# Altium schematic sheet fitolamp_shc.SchDoc
size A2
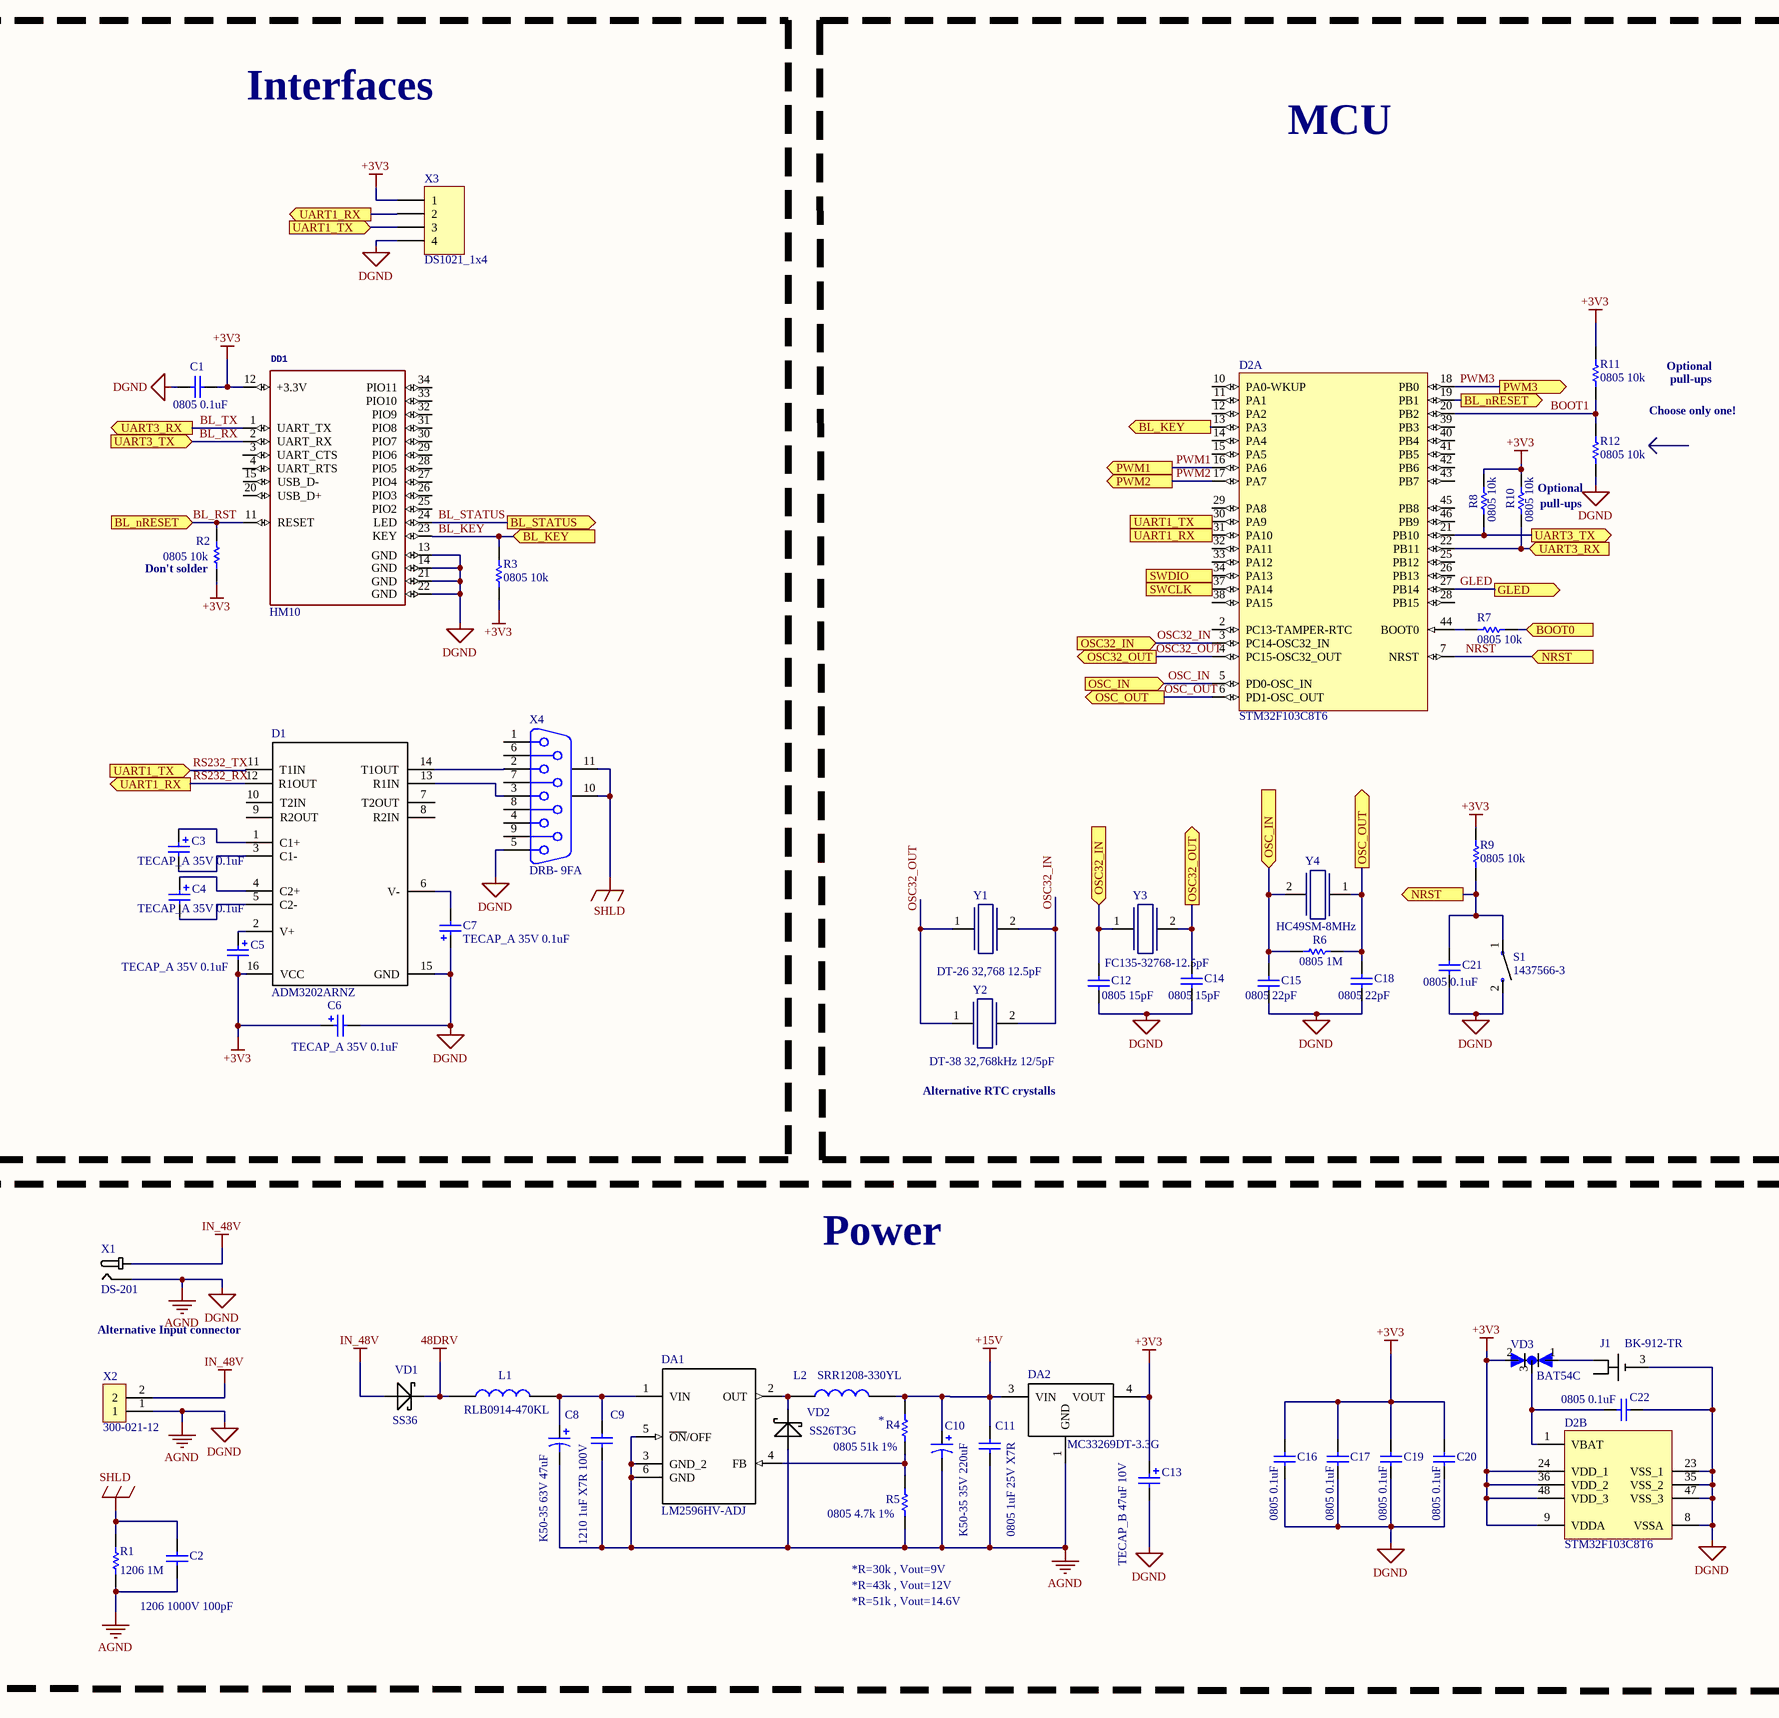
[diagram p0: fitolamp_shc.SchDoc, left]
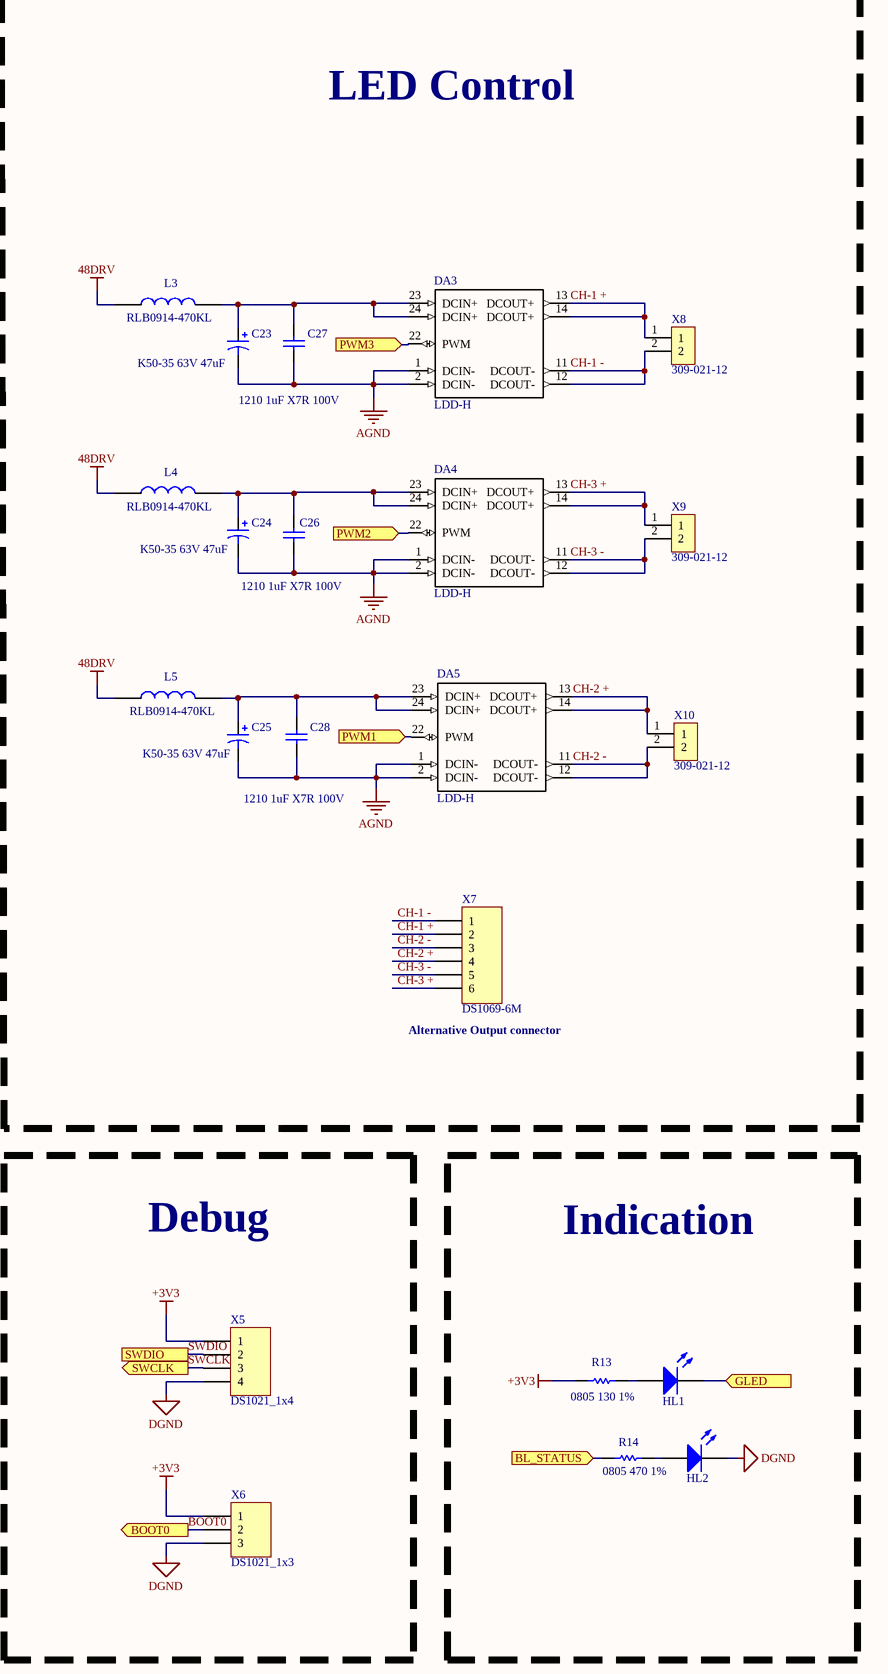
[diagram p1: fitolamp_shc.SchDoc, right]

## Parts
C1  0805 0.1uF  [C_SMD0805]
C2  1206 1000V 100pF  [C_SMD1206]
C3  TECAP_A 35V 0.1uF  [TECAP_A]
C4  TECAP_A 35V 0.1uF  [TECAP_A]
C5  TECAP_A 35V 0.1uF  [TECAP_A]
C6  TECAP_A 35V 0.1uF  [TECAP_A]
C7  TECAP_A 35V 0.1uF  [TECAP_A]
C8  K50-35 63V 47uF  [K50-35 6.3x11x2.5]
C9  1210 1uF X7R 100V  [C_SMD1210]
C10  K50-35 35V 220uF  [K50-35 8x11.5x3.5]
C11  0805 1uF 25V X7R  [C_SMD0805]
C12  0805 15pF  [C_SMD0805]
C13  TECAP_B 47uF 10V  [TECAP_B]
C14  0805 15pF  [C_SMD0805]
C15  0805 22pF  [C_SMD0805]
C16  0805 0.1uF  [C_SMD0805]
C17  0805 0.1uF  [C_SMD0805]
C18  0805 22pF  [C_SMD0805]
C19  0805 0.1uF  [C_SMD0805]
C20  0805 0.1uF  [C_SMD0805]
C21  0805 0.1uF  [C_SMD0805]
C22  0805 0.1uF  [C_SMD0805]
C23  K50-35 63V 47uF  [K50-35 6.3x11x2.5]
C24  K50-35 63V 47uF  [K50-35 6.3x11x2.5]
C25  K50-35 63V 47uF  [K50-35 6.3x11x2.5]
C26  1210 1uF X7R 100V  [C_SMD1210]
C27  1210 1uF X7R 100V  [C_SMD1210]
C28  1210 1uF X7R 100V  [C_SMD1210]
D1  ADM3202ARNZ  [SOIC-16]
D2  STM32F103C8T6  [STM-LQFP48_N]  (parts A,B of 2)
DA1  LM2596HV-ADJ  [TO263-5 - heatsink]
DA2  MC33269DT-3.3G  [DPAK229P990X238-3N]
DA3  LDD-H  [LDD-H]
DA4  LDD-H  [LDD-H]
DA5  LDD-H  [LDD-H]
DD1  HM10  [HM10_BOARD]
HL1  LED_0_25_4  [LED0254_SMD]  (value not drawn)
HL2  LED_0_25_4  [LED0254_SMD]  (value not drawn)
J1  BK-912-TR  [BK-912-TR_batt]
L1  RLB0914-470KL  [RLB0914]
L2  SRR1208-330YL  [SRR1208]
L3  RLB0914-470KL  [RLB0914]
L4  RLB0914-470KL  [RLB0914]
L5  RLB0914-470KL  [RLB0914]
R1  1206 1M  [R_SMD1206]
R2  0805 10k  [R_SMD0805]
R3  0805 10k  [R_SMD0805]
R4  0805 51k 1%  [R_SMD0805]
R5  0805 4.7k 1%  [R_SMD0805]
R6  0805 1M  [R_SMD0805]
R7  0805 10k  [R_SMD0805]
R8  0805 10k  [R_SMD0805]
R9  0805 10k  [R_SMD0805]
R10  0805 10k  [R_SMD0805]
R11  0805 10k  [R_SMD0805]
R12  0805 10k  [R_SMD0805]
R13  0805 130 1%  [R_SMD0805]
R14  0805 470 1%  [R_SMD0805]
S1  1437566-3  [1437566-3]
VD1  SS36  [DO214AB SMC]
VD2  SS26T3G  [DO-214AA]
VD3  BAT54C  [BAT54C_SOT23-3]
X1  DS-201  [DS-201]
X2  300-021-12  [300-021-12]
X3  DS1021_1x4  [PLD1X4]
X4  DRB- 9FA  [DRB- 9FA]
X5  DS1021_1x4  [PLD1X4]
X6  DS1021_1x3  [PLD1x3]
X7  DS1069-6M  [DS1069-6MR]
X8  309-021-12  [390-021-12]
X9  309-021-12  [390-021-12]
X10  309-021-12  [390-021-12]
Y1  DT-26 32,768 12.5pF  [DT-26]
Y2  DT-38 32,768kHz 12/5pF  [DT-38]
Y3  FC135-32768-12.5pF  [FC-135]
Y4  HC49SM-8MHz  [HC49SM]

## Blocks framed on the sheet
Interfaces: C1 C3-C7 D1 DD1 R2 R3 X3 X4

## Ports
BL_KEY (in), BL_KEY (out), BL_nRESET (in), BL_nRESET (out), BL_STATUS (in), BL_STATUS (out), BOOT0 (in), BOOT0 (out), GLED (in), GLED (out), NRST (in), NRST (out), OSC32_IN (in), OSC32_OUT (out), OSC_IN (in), OSC_OUT (out), PWM1 (in), PWM1 (out), PWM2 (in), PWM2 (out), PWM3 (in), PWM3 (out), SWCLK (in), SWCLK (out), SWDIO, UART1_RX (in), UART1_RX (out), UART1_TX (in), UART1_TX (out), UART3_RX (in), UART3_RX (out), UART3_TX (in), UART3_TX (out)

## Nets
48DRV: L1.1 L3.1 L4.1 L5.1 VD1.2(NEG)
+3V3: C1.1 C5.2 C6.1 C13.1 C16.2 C17.2 C19.2 C20.2 D1.16(VCC) D2.9(VDDA) D2.24(VDD_1) D2.36(VDD_2) D2.48(VDD_3) DA2.4(VOUT) DD1.12(+3.3V) R2.2 R3.2 R8.1 R9.1 R10.1 R11.1 R13.1 VD3.2(A2) X3.1 X5.1 X6.1
+15V: C10.1 C11.2 DA2.3(VIN) L2.2 R4.2
AGND: C1.2 C2.1 C6.2 C7.1 C8.2 C9.1 C10.2 C11.1 C12.1 C13.2 C14.1 C15.1 C16.1 C17.1 C18.1 C19.1 C20.1 C21.1 C22.1 C23.2 C24.2 C25.2 C26.1 C27.1 C28.1 D1.15(GND) D2.8(VSSA) D2.23(VSS_1) D2.35(VSS_2) D2.47(VSS_3) DA1.3(GND_2) DA1.5(~{ON}/OFF) DA1.6(GND) DA2.1(GND) DA3.1(DCIN-) DA3.2(DCIN-) DA4.1(DCIN-) DA4.2(DCIN-) DA5.1(DCIN-) DA5.2(DCIN-) DD1.13(GND) DD1.14(GND) DD1.21(GND) DD1.22(GND) HL2.2(K) J1.3(NEG) R1.1 R5.1 R12.2 S1.2 VD2.2(POS) X1.1(SHIELD) X2.1 X3.4 X4.5 X5.4 X6.3  [also labelled DGND]
IN_48V: VD1.1(POS) X1.2 X2.2
SHLD: C2.2 R1.2 X4.10(MH1) X4.11(MH2)
BL_KEY: D2.13(PA3) DD1.23(KEY) R3.1 ; port BL_KEY
BL_RST: D2.19(PB1) DD1.11(RESET) R2.1 ; port BL_nRESET
BL_RX: D2.21(PB10) DD1.2(UART_RX) R8.2 ; port UART3_TX
BL_STATUS: DD1.24(LED) R14.1 ; port BL_STATUS
BL_TX: D2.22(PB11) DD1.1(UART_TX) R10.2 ; port UART3_RX
BOOT0: R7.2 X6.2 ; port BOOT0
BOOT1: D2.20(PB2) R11.2 R12.1
CH-1 +: DA3.13(DCOUT+) DA3.14(DCOUT+) X7.2 X8.1
CH-1 -: DA3.11(DCOUT-) DA3.12(DCOUT-) X7.1 X8.2
CH-2 +: DA5.13(DCOUT+) DA5.14(DCOUT+) X7.4 X10.1
CH-2 -: DA5.11(DCOUT-) DA5.12(DCOUT-) X7.3 X10.2
CH-3 +: DA4.13(DCOUT+) DA4.14(DCOUT+) X7.6 X9.1
CH-3 -: DA4.11(DCOUT-) DA4.12(DCOUT-) X7.5 X9.2
GLED: D2.27(PB14) HL1.2(K) ; port GLED
NRST: C21.2 D2.7(NRST) R9.2 S1.1 ; port NRST
OSC32_IN: C12.2 D2.3(PC14-OSC32_IN) Y1.2 Y2.2 Y3.1 ; port OSC32_IN
OSC32_OUT: C14.2 D2.4(PC15-OSC32_OUT) Y1.1 Y2.1 Y3.2 ; port OSC32_OUT
OSC_IN: C15.2 D2.5(PD0-OSC_IN) R6.2 Y4.2 ; port OSC_IN
OSC_OUT: C18.2 D2.6(PD1-OSC_OUT) R6.1 Y4.1 ; port OSC_OUT
PWM1: D2.16(PA6) DA5.22(PWM) ; port PWM1
PWM2: D2.17(PA7) DA4.22(PWM) ; port PWM2
PWM3: D2.18(PB0) DA3.22(PWM) ; port PWM3
RS232_RX: D1.12(R1OUT) D2.31(PA10) X3.2 ; port UART1_RX
RS232_TX: D1.11(T1IN) D2.30(PA9) X3.3 ; port UART1_TX
SWCLK: D2.37(PA14) X5.3 ; port SWCLK
SWDIO: D2.34(PA13) X5.2 ; port SWDIO
NetC3_1: C3.1 D1.1(C1+)
NetC3_2: C3.2 D1.3(C1-)
NetC4_1: C4.1 D1.4(C2+)
NetC4_2: C4.2 D1.5(C2-)
NetC5_1: C5.1 D1.2(V+)
NetC7_2: C7.2 D1.6(V-)
NetC8_1: C8.1 C9.2 DA1.1(VIN) L1.2
NetC22_2: C22.2 D2.1(VBAT) VD3.3(C)
NetC23_1: C23.1 C27.2 DA3.23(DCIN+) DA3.24(DCIN+) L3.2
NetC24_1: C24.1 C26.2 DA4.23(DCIN+) DA4.24(DCIN+) L4.2
NetC25_1: C25.1 C28.2 DA5.23(DCIN+) DA5.24(DCIN+) L5.2
NetD1_13: D1.13(R1IN) X4.3
NetD1_14: D1.14(T1OUT) X4.2
NetD2_44: D2.44(BOOT0) R7.1
NetDA1_2: DA1.2(OUT) L2.1 VD2.1(NEG)
NetDA1_4: DA1.4(FB) R4.1 R5.2
NetHL1_1: HL1.1(A) R13.2
NetHL2_1: HL2.1(A) R14.2
NetJ1_2: J1.2(POS) VD3.1(A1)

Not connected (* = marked no-connect by the designer): D1 7(T2OUT) 8(R2IN) 9(R2OUT) 10(T2IN); D2 2(PC13-TAMPER-RTC) 10(PA0-WKUP) 11(PA1) 12(PA2) 14(PA4) 15(PA5) 25(PB12) 26(PB13) 28(PB15) 29(PA8) 32(PA11) 33(PA12) 38(PA15) 39(PB3) 40(PB4) 41(PB5) 42(PB6) 43(PB7) 45(PB8) 46(PB9); DD1 3(UART_CTS) 4(UART_RTS) 15(USB_D-) 20(USB_D+) 25(PIO2) 26(PIO3) 27(PIO4) 28(PIO5) 29(PIO6) 30(PIO7) 31(PIO8) 32(PIO9) 33(PIO10) 34(PIO11); J1 1(POS); X4 1 4 6 7 8 9

## Notes on the sheet
- MCU
- LED Control
- Choose only one!
- Optional
- pull-ups
- (near R10) pull-ups
- (near R2) Don't solder
- (near X7) Alternative Output connector
- Alternative RTC crystalls
- Power
- Debug
- Indication
- Alternative Input connector
- *
- *R=43k , Vout=12V
- *R=51k , Vout=14.6V
- (near R5) *R=30k , Vout=9V

## Library data of the parts
C1 C11 C12 C14-C22 = C0805: SMD Cap 0805
C2 = C1206: SMD Cap 1206
C3-C7 = TECAP_A: Tantalum pol cap type A
C8 C10 C23-C25 = K50-35mini: Конденсатор электролитический алюминиевый
C9 C26-C28 = C1210: Cap SMD1210
C13 = TECAP_B: Tantalum pol cap type B
D1 = ADM3202ARNZ: 3.3V SMD RS232-UART
D2 = STM32F103C8T6: ARM Cortex-M3 32-bit MCU, 64 KB Flash, 20 KB Internal RAM, 37 I/Os, 48-pin LQFP, -40 to 85 degC, Tray; A/D Converter: 2x12-bit (10 Channel); FLASH Size (Prog) (kB): 64; I/Os (High Current): 37; Internal RAM Size (kB): 20; Operating Frequency(F) (Processor speed) (MHz): 72; Supply Voltage(Vcc) min (V): 2; DatasheetVersion: Rev. 16; PackageVersion: Rev. 6, 06/2013; PackageReference: LQFP48; PackageDescription: 48-Pin Low Profile Quad Flat Package, 7 x 7 mm Body, 0.5 mm Pitch; Supplier 1: Digi-Key; Supplier Part Number 1: 497-6063-ND; Supplier 2: Farnell; Supplier Part Number 2: 1447637; Supplier 3: Newark; Supplier Part Number 3: 59M2182; Supplier 4: Newark; Supplier Part Number 4: 57P1222; Supplier 5: Mouser; Supplier Part Number 5: 511-STM32F103C8T6; Core: ARM Cortex-M3; Packing: Tray; Mounting Technology: Surface Mount; PartNumber: STM32F103C8T6; ComponentLink1Description: Manufacturer URL; ComponentLink1URL: http://www.st.com/web/en/home.html; ComponentLink2Description: Datasheet; ComponentLink2URL: http://www.st.com/st-web-ui/static/active/en/resource/technical/document/datasheet/CD00161566.pdf; ComponentLink3Description: Package Specification; ComponentLink3URL: http://www.st.com/st-web-ui/static/active/en/resource/technical/document/datasheet/DM00058181.pdf
DA1 = LM2596HV: SIMPLE SWITCHER4; 4V to 60V, 3A Low Component Count Step-Down Regulator
DA2 = MC33269DT-3.3G: 800mA,3.3V,LDO Voltage Reg,MC33269DT-3.3 MC33269DT-3.3G, Low Dropout Voltage Regulator, 0.8A, 3.3 V 1%, 3-Pin DPAK
DA3-DA5 = LDD-H: LED Power Supplies
DD1 = HM-10-BOARD: BLE4.0-module 3.3V / HM Bluetooth module use TI CC2540 or CC2541, Master and slave roles in one, transmission version and remote control version and PIO state acquisition functions in one, Support the AT command modify module parameters, Convenient and flexible.; GateName_1: G$1; SymbolName_1: HM-10; DeviceName: -BOARD; LibraryName: JNHuaMao; DeviceSetName: HM-10; Package: 26.9X13X2.2_BOARD
HL1 HL2 = LED_0_25_4: Throw Hole 3mm diameter LED
J1 = BK-912-TR: Holder Coin Cell 20mm Smd
L1 L3-L5 = RLB0914: Радиальные выводные индуктивности / Диапазон рабочих температур –20 °С… +80 °С. / Рост температуры в процессе эксплуатации, не более 20 °С. / Диапазон индуктивностей 1 - 82000 мкГ
L2 = SRR1208-682KL: Fixed Inductors 6800uH 10% SMD 1208
R1 = R1206: SMD Res 1206
R2-R14 = R0805: SMD Res 0805
S1 = 1437566-3: SMD button
VD1 = SS36: Rectifier, Schottky; DO-214AB; 3.0A IF; 0.75V; 60V; 100A IFRM; 10000V/us; 1000pF
VD2 = SS26T3G: Диод Шоттки 2А 60В [SMB / DO-214AA]
VD3 = BAT54C: Small Signal Schottky Diode, Dual Common Cathode, 30 V, 200 mA, 400 mV, 600 mA, 125 C
X1 = DS-201: Гнездо питания 2,1х5,5на плату
X2 = 300-021-12: Klemmnik 2
X3 X5 = DS1021_1x4: Вилка штыревая 2.54мм 1x4 прямая тип1
X4 = DRB- 9FA (DS1037-9F)
X6 = DS1021_1x3: Вилка штыревая 2.54мм 1x3 прямая тип1
X7 = DS1069-6M: Вилка Dip угловая, шаг 2.50мм Номинальный ток: 3А АС, DC Max
X8-X10 = 309-021-12: DG390-5.0-02P (XY118-2P-05) Зажимной Клеммник 2-контактный, 5.0мм угловой
Y1 = DT-26: 32,768 кГц имп. цил.2x6мм, DT-26, Кварцевый резонатор 12.5pF
Y2 = DT-38: 32,768 кГц имп. цил.3x8мм DT-38, Кварцевый резонатор 12/5pF
Y3 = FC135-32768-7: Clock SMD Crystal
Y4 = HC49SM